# EasyEDA Pro project 2021江西省焊接赛.eprj

# Schematic Schematic1
Create Date: 2024-03-24; Page Name: P1; Project Name: 2021江西省焊接赛; Schematic Name: Schematic1; Update Date: 2024-03-24; Company: 嘉立创EDA; Page Size: A4; Version: V1.0
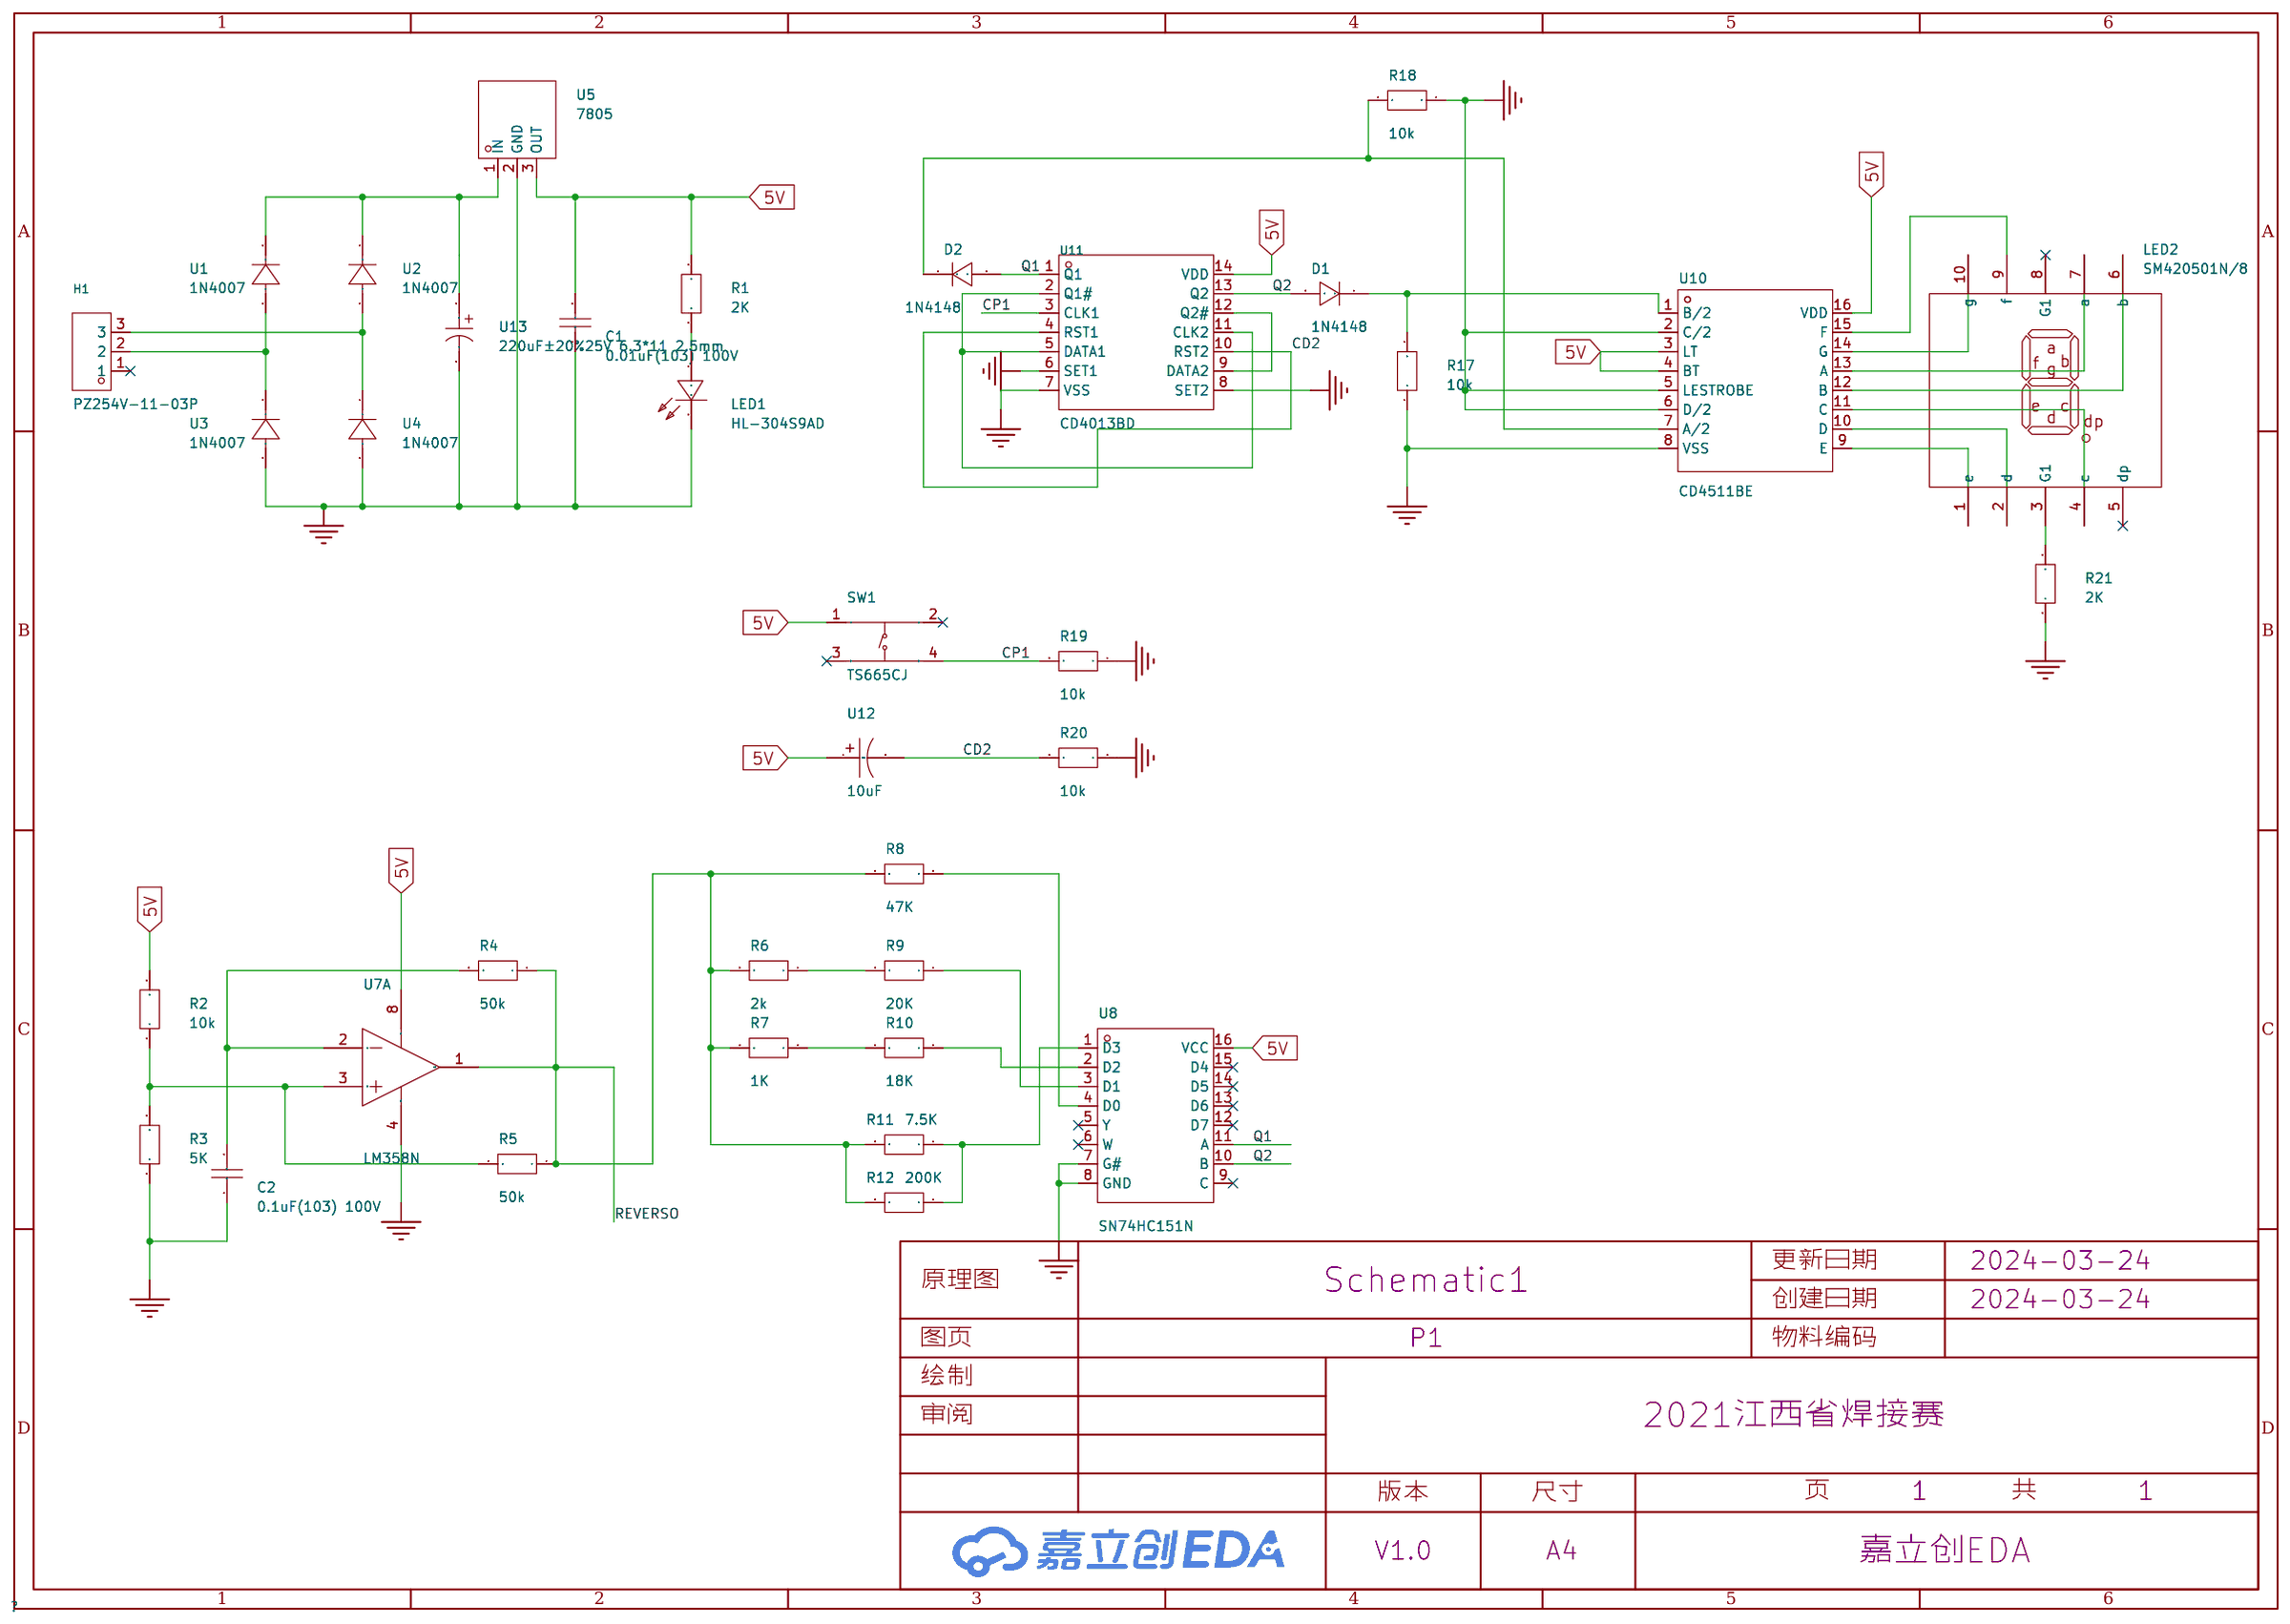
[diagram p0: schematic sheet]

## Parts
C1  0.01uF(103) 100V  [CAP-TH_L5.5-W3.0-P5.00-D0.5]
C2  0.1uF(103) 100V  [CAP-TH_L5.5-W3.0-P5.00-D0.5]
D1  1N4148  [DO-35_BD2.0-L4.0-P8.0-D0.5-RD]
D2  1N4148  [DO-35_BD2.0-L4.0-P8.0-D0.5-RD]
H1  PZ254V-11-03P  [HDR-TH_3P-P2.54-V-M]
LED1  HL-304S9AD  [LED-TH_BD3.0-P2.54-FD]
LED2  SM420501N/8  [LED-SEG-TH_10P-L12.7-W19.0-P2.54-S15.24-BL]
R1  2K  [RES-TH_BD2.3-L6.5-P10.50-D0.5]
R2  10k  [RES-TH_BD2.3-L6.5-P10.50-D0.5]
R3  5K  [RES-TH_BD2.3-L6.5-P10.50-D0.5]
R4  50k  [RES-TH_BD2.3-L6.5-P10.50-D0.5]
R5  50k  [RES-TH_BD2.3-L6.5-P10.50-D0.5]
R6  2k  [RES-TH_BD2.3-L6.5-P10.50-D0.5]
R7  1K  [RES-TH_BD2.3-L6.5-P10.50-D0.5]
R8  47K  [RES-TH_BD2.3-L6.5-P10.50-D0.5]
R9  20K  [RES-TH_BD2.3-L6.5-P10.50-D0.5]
R10  18K  [RES-TH_BD2.3-L6.5-P10.50-D0.5]
R11  7.5K  [RES-TH_BD2.3-L6.5-P10.50-D0.5]
R12  200K  [RES-TH_BD2.3-L6.5-P10.50-D0.5]
R17  10k  [RES-TH_BD2.3-L6.5-P10.50-D0.5]
R18  10k  [RES-TH_BD2.3-L6.5-P10.50-D0.5]
R19  10k  [RES-TH_BD2.3-L6.5-P10.50-D0.5]
R20  10k  [RES-TH_BD2.3-L6.5-P10.50-D0.5]
R21  2K  [RES-TH_BD2.3-L6.5-P10.50-D0.5]
SW1  TS665CJ  [SW-TH_4P-L6.0-W6.0-P4.50-LS6.5]
U1  1N4007  [DO-41_BD2.8-L5.2-P9.20-D0.8-RD]
U2  1N4007  [DO-41_BD2.8-L5.2-P9.20-D0.8-RD]
U3  1N4007  [DO-41_BD2.8-L5.2-P9.20-D0.8-RD]
U4  1N4007  [DO-41_BD2.8-L5.2-P9.20-D0.8-RD]
U5  7805  [TO-220-3_L10.2-W4.5-P2.54-L-1]
U7  LM358N  [DIP-8_L9.2-W6.3-P2.54-LS7.62-BL]  (section 1)
U8  SN74HC151N  [PDIP-16_L19.7-W6.6-P2.54-LS7.8-BL]
U10  CD4511BE  [DIP-16_L19.8-W6.5-P2.54-LS7.6-BL]
U11  CD4013BD  [DIP-14_L19.6-W6.4-P2.54-LS7.6-BL]
U12  10uF  [CAP-TH_BD6.3-P2.50-D0.5-FD]
U13  220uF±20%25V 6.3*11 2.5mm  [CAP-TH_BD6.3-P2.50-D0.5-FD]

## Library data of the parts
C1 C2 = 0.01uF(103) 100V: LCSC Part Name: 10nF (103) 100V   P=5mm; Supplier Part: C10722; Supplier Footprint: 插件; JLCPCB Part Class: 扩展库; Supplier: LCSC
D1 D2 = 1N4148_C13769: 二极管配置:-;正向压降(Vf):-;直流反向耐压(Vr):-;平均整流电流(Io):-;; Supplier Part: C13769; Supplier Footprint: DO-35; JLCPCB Part Class: 扩展库; Supplier: LCSC
H1 = PZ254V-11-03P: 插针结构:1x3P;间距:2.54mm;行距:-;圆针/方针:方针;安装类型:直插;排数:单排;总PIN位数:3P;额定电流:3A;额定电压:250V;配合针长度:6mm;塑高:2.5mm;端接针长度:3mm;工作温度范围:-40℃~+105℃;颜色:黑色;; LCSC Part Name: 间距:2.54mm 1x3P 直插 方针; Supplier Part: C2937625; Manufacturer: XFCN(兴飞); Supplier Footprint: 插件,P=2.54mm; JLCPCB Part Class: 扩展库; Datasheet: https://atta.szlcsc.com/upload/public/pdf/source/20200309/C492402_8335C3D49C4E4C618838D59BB1D024C1.pdf; Supplier: LCSC; Pin Structure: 1x3P; Pitch: 2.54mm; Circluar Pins/Square Pins: 方针; Mounting Type: 直插; Number of Rows: 单排; Number of Pins: 3P; Current Rating (Max): 3A; Voltage Rating (Max): 250V; Length of Mating Pin: 6mm; Insulation Height: 2.5mm; Length of End Connection Pin: 3mm; Operating Temperature Range: -40℃~+105℃; Color: 黑色
LED1 = HL-304S9AD: 灯头类型:3mm圆形灯头;发光颜色:红色;正向电压(VF):2.2V;功率:66mW;正向电流:20mA;主波长:627nm~635nm;二极管配置:-;透镜颜色:雾状红透镜;色温:-;发光强度:460mcd;发光角度:40°;载带方式:-;工作温度:-30℃~+80℃;; Supplier Part: C568936; Manufacturer: HONGLITRONIC(鸿利光电); Supplier Footprint: 插件,D=3mm; JLCPCB Part Class: 扩展库; Datasheet: https://atta.szlcsc.com/upload/public/pdf/source/20200630/C568936_361459151DDEDF72172B9683A2A9AC96.pdf; Supplier: LCSC; Lamp Holder Type: 3mm圆形灯头; Emitted Color: 红色; Forward Voltage (VF): 2.2V; Power Dissipation: 66mW; Forward Current: 20mA; Dominant Wavelength: 627nm~635nm; Lens Color: 雾状红透镜; Luminous Intensity: 460mcd; Viewing Angle: 40°; Operating Temperature: -30℃~+80℃
LED2 = SM420501N/8: 数码管位数:1位;发光颜色:红色;LED极性:共阴极;数字/字母大小(英寸):0.5;; LCSC Part Name: 1位0.5英寸红色数码管 共阴极; Supplier Part: C252201; Manufacturer: ARKLED(方舟); Supplier Footprint: 插件; JLCPCB Part Class: 扩展库; Datasheet: https://atta.szlcsc.com/upload/public/pdf/source/20180821/C252201_1E0130B228B09D4E21858CDC1E7784AB.pdf; Supplier: LCSC; Number of Characters: 1位; Luminous Color: 红色; LED Polarity: 共阴极; Digit/Alpha Size(inch): 0.5
R1-R12 R17-R21 = MF1/4W-1KΩ±1%T52: 电阻类型:金属膜电阻;阻值:1kΩ;精度:±1%;功率:250mW;温度系数:±200ppm/℃;; LCSC Part Name: 金属膜电阻 1kΩ ±1% 250mW; Supplier Part: C713997; Manufacturer: 华星机电; Supplier Footprint: 插件; JLCPCB Part Class: Extended Part; Datasheet: https://atta.szlcsc.com/upload/public/pdf/source/20200731/C713882_AE8EB1102749D7E4FB4FB13DC898C429.pdf; Supplier: LCSC; Type: 金属膜电阻; Tolerance: ±1%; Power(Watts): 250mW; Temperature Coefficient: ±200ppm/℃
SW1 = TS665CJ: 电路结构:单刀单掷;按钮形状:圆形按钮;安装方式:直插;开关长度:6mm;开关宽度:6mm;开关高度:5mm;触点电流:50mA;额定电压(DC):12V;带灯:-;机械寿命:-;; LCSC Part Name: 6*6*5mm 直插 轻触开关; Supplier Part: C393938; Manufacturer: SHOU HAN(首韩); Supplier Footprint: 插件; JLCPCB Part Class: 扩展库; Datasheet: https://atta.szlcsc.com/upload/public/pdf/source/20190521/C393938_BDABEAC600B4C55E200A80AA129B70BC.pdf; Supplier: LCSC; Circuit: 单刀单掷; Actuator Style: 圆形按钮; Mounting Style: 直插; Switch Length: 6mm; Switch Width: 6mm; Switch Height: 5mm; Contact Current: 50mA; Voltage Rating (DC): 12V
U1-U4 = 1N4007_C19272205: Supplier Part: C19272205; Manufacturer: Zhengxin(正芯); Supplier Footprint: DO-41; Datasheet: https://atta.szlcsc.com/upload/public/pdf/source/20231208/D31AFEBA3B57F695AB8DB795E02A4800.pdf; Supplier: LCSC
U5 = 7805: 输出类型:固定;最大输入电压:35V;输出电压:5V;最大输出电流:1.5A;电源纹波抑制比(PSRR):62dB@(120Hz);输出极性:正极;; LCSC Part Name: 输入35V 输出5V 1.5A; Supplier Part: C4944936; Manufacturer: SY(顺烨）; Supplier Footprint: TO-220AB; JLCPCB Part Class: 扩展库; Datasheet: https://atta.szlcsc.com/upload/public/pdf/source/20220719/323A3F14557C229271C454C7C0F759A5.pdf; Supplier: LCSC; Output Type: 固定; Maximum Input Voltage: 35V; Output Voltage: 5V; MAX Output Current: 1.5A; Power Supply Rejection Ratio (PSRR): 62dB@(120Hz); Output Polarity: 正极
U7 = LM358N: 放大器数:-;; Supplier Part: C434570; Manufacturer: HGSEMI(华冠); Supplier Footprint: DIP-8; JLCPCB Part Class: 扩展库; Datasheet: https://atta.szlcsc.com/upload/public/pdf/source/20201104/C398078_C03AD53C2769C23315C184712D62478F.pdf; Supplier: LCSC
U8 = SN74HC151N: 供电电压:2V~6V;灌电流(IOL):7.8mA;拉电流(IOH):7.8mA;; Supplier Part: C157528; Manufacturer: TI(德州仪器); Supplier Footprint: PDIP-16; Datasheet: https://www.ti.com/cn/lit/gpn/sn74hc151; Supplier: LCSC; Type: 多路复用器; Voltage Supply Source: 单电源; Supply Voltage: 2V~6V; Sink Current: 7.8mA; Source Current: 7.8mA; Operating temperature: -40℃~+85℃
U10 = CD4511BE: CD4511B CMOS BCD 到 7 段 LED 锁存解码器驱动器; Supplier Part: C5327; Manufacturer: TI(德州仪器); Supplier Footprint: DIP-16; JLCPCB Part Class: 扩展库; Datasheet: https://www.ti.com/cn/lit/gpn/cd4511b; Supplier: LCSC
U11 = CD4013BD: 类型:D-型;; Supplier Part: C5274713; Manufacturer: Sungine(双竞集成); Supplier Footprint: DIP-14; Datasheet: https://atta.szlcsc.com/upload/public/pdf/source/20221121/44CACF82E4E0EA70321374EADD4D28B0.pdf; Supplier: LCSC; Type: D-型
U12 = MHT10UF400V87EC0217: 容值:10uF;精度:±20%;额定电压:400V;纹波电流:-;等效串联电阻:-;; LCSC Part Name: 10uF ±20% 400V; Supplier Part: C3034527; Manufacturer: KNSCHA(科尼盛); Supplier Footprint: 插件,D6.3xL16mm; JLCPCB Part Class: 扩展库; Datasheet: https://atta.szlcsc.com/upload/public/pdf/source/20220613/BAC6EB237FF3CCD33B76A42FEFFA13DA.pdf; Supplier: LCSC; Tolerance: ±20%; Rated Voltage: 400V; φD: 6.3mm; L: 16mm
U13 = 220uF±20%25V 6.3*11 2.5mm: Supplier Part: C9900018463; Supplier Footprint: 220uF±20％25V-6.3*11-2.5mm-吉光; JLCPCB Part Class: 扩展库; Supplier: LCSC

## Nets
5V: C1.2 R1.2 R2.2 SW1.1(A) U5.3(OUT) U7.8(VCC) U8.16(VCC) U10.3(LT) U10.4(BT) U10.16(VDD) U11.14(VDD) U12.1
GND: C1.1 C2.1 LED1.2(C) R3.1 R17.1 R18.1 R19.1 R20.1 R21.1 U3.2(A) U4.2(A) U5.2(GND) U7.4(GND) U8.7(G#) U8.8(GND) U10.2(C/2) U10.5(LESTROBE) U10.6(D/2) U10.8(VSS) U11.6(SET1) U11.7(VSS) U11.8(SET2) U13.2
CD2: R20.2 U11.4(RST1) U11.10(RST2) U12.2
CP1: R19.2 SW1.4(D) U11.3(CLK1)
Q1: D2.2 U8.11(A) U11.1(Q1)
Q2: D1.2 U8.10(B) U11.13(Q2)
REVERSO: R4.1 R5.1 R6.2 R7.2 R8.2 R11.2 R12.2 U7.1(OUT1)
$1N523: LED1.1(A) R1.1
$1N655: H1.3 U2.2(A) U4.1(K)
$1N665: H1.2 U1.2(A) U3.1(K)
$1N699: U1.1(K) U2.1(K) U5.1(IN) U13.1
$1N984: C2.2 R4.2 U7.2(IN1-)
$1N1320: R2.1 R3.2 R5.2 U7.3(IN1+)
$1N1806: R11.1 R12.1 U8.1(D3)
$1N1814: R10.1 U8.2(D2)
$1N1819: R7.1 R10.2
$1N1822: R6.1 R9.2
$1N1825: R9.1 U8.3(D1)
$1N1830: R8.1 U8.4(D0)
$1N3999: LED2.9(f) U10.15(F)
$1N4011: LED2.10(g) U10.14(G)
$1N4015: LED2.7(a) U10.13(A)
$1N4019: LED2.6(b) U10.12(B)
$1N4023: LED2.4(c) U10.11(C)
$1N4027: LED2.2(d) U10.10(D)
$1N4031: LED2.1(e) U10.9(E)
$1N4101: LED2.3(G1) R21.2
$1N5836: D1.1 R17.2 U10.1(B/2)
$1N5995: D2.1 R18.2 U10.7(A/2)
$1N6063: U11.9(DATA2) U11.12(Q2#)
$1N6114: U11.2(Q1#) U11.5(DATA1) U11.11(CLK2)

Not connected (* = marked no-connect by the designer): H1 1*; LED2 5(dp)* 8(G1)*; SW1 2(B)* 3(C)*; U8 5(Y)* 6(W)* 9(C)* 12(D7)* 13(D6)* 14(D5)* 15(D4)*

# Board PCB1
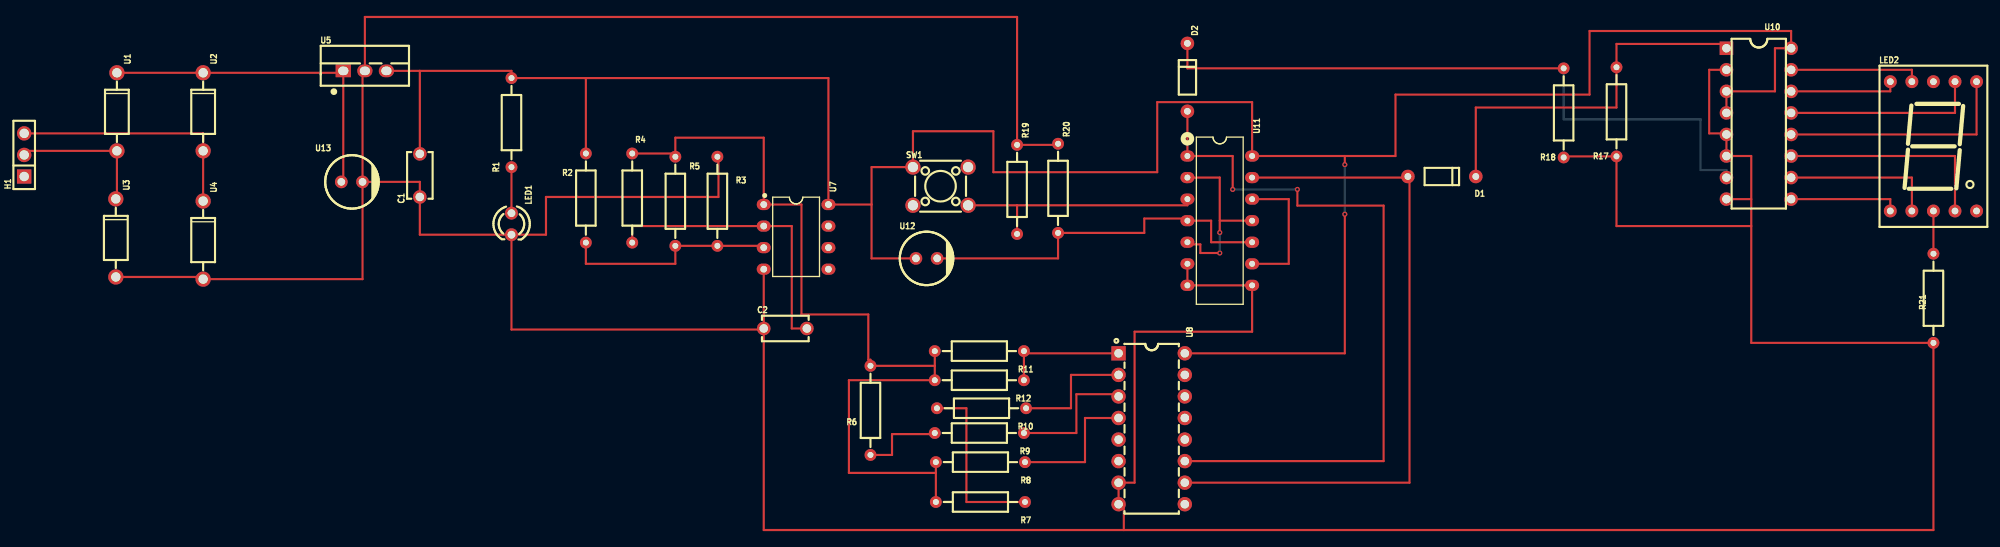
[diagram p1: board, top side]
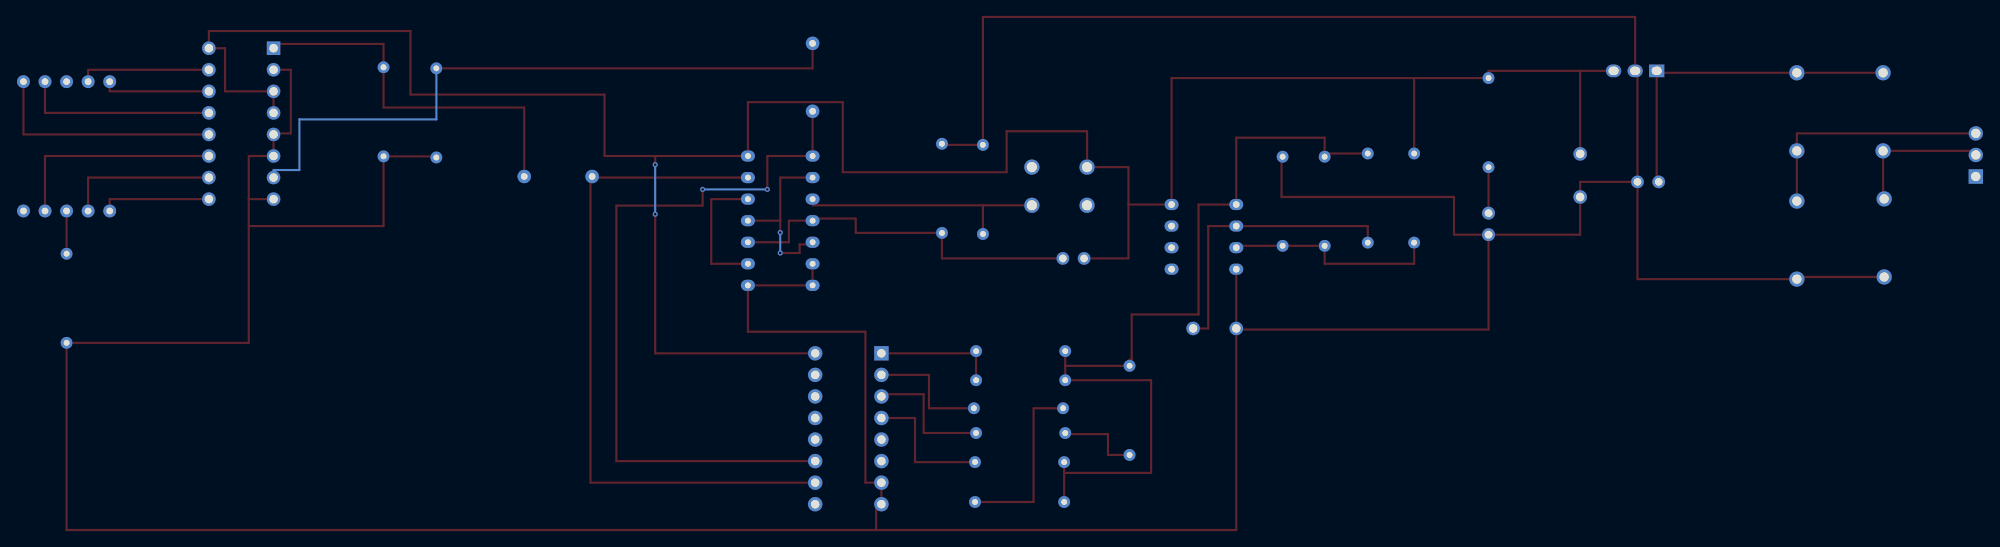
[diagram p2: board, bottom side, seen from below]

No outline. copper layers: Top Layer, Bottom Layer. Coordinates in mm from the lowest, leftmost part position.
Stack: Top Layer 0.035mm / Dielectric1 1.51mm FR4 er 4.5 / Bottom Layer 0.035mm

## Design rules (mm)
template: JLCPCB Capability(Two Layers Board)
spacing copperThickness1oz (default): track to track 0.102, other pairs 0.152 to 0.3
spacing copperThickness2oz: track to track 0.203, other pairs 0.152 to 0.3
track width copperThickness1oz (default): min 0.127, default 0.254, max 2.54
track width copperThickness2oz: min 0.203, default 0.254, max 2.54
differential pair differentialPair (default): width min 0.127, default 0.254, max 2.54; gap min 0.152, default 0.152
via viaSize (default): diameter min 0.5, default 0.61, max 10; hole min 0.3, default 0.305, max 6.3

## Placement (name value [footprint] x y rotation side)
C1  0.01uF(103) 100V  [CAP-TH_L5.5-W3.0-P5.00-D0.5]  46.61 38.48 90 top
C2  0.1uF(103) 100V  [CAP-TH_L5.5-W3.0-P5.00-D0.5]  89.66 20.45 0 top
D1  1N4148  [DO-35_BD2.0-L4.0-P8.0-D0.5-RD]  167 38.35 180 top
D2  1N4148  [DO-35_BD2.0-L4.0-P8.0-D0.5-RD]  137.03 50.04 270 top
H1  PZ254V-11-03P  [HDR-TH_3P-P2.54-V-M]  0 40.89 90 top
LED1  HL-304S9AD  [LED-TH_BD3.0-P2.54-FD]  57.4 32.77 270 top
LED2  SM420501N/8  [LED-SEG-TH_10P-L12.7-W19.0-P2.54-S15.24-BL]  224.92 41.91 0 top
R1  2K  [RES-TH_BD2.3-L6.5-P10.50-D0.5]  57.4 44.7 90 top
R2  10k  [RES-TH_BD2.3-L6.5-P10.50-D0.5]  66.17 35.81 90 top
R3  5K  [RES-TH_BD2.3-L6.5-P10.50-D0.5]  81.66 35.43 270 top
R4  50k  [RES-TH_BD2.3-L6.5-P10.50-D0.5]  71.63 35.81 270 top
R5  50k  [RES-TH_BD2.3-L6.5-P10.50-D0.5]  76.71 35.43 270 top
R6  2k  [RES-TH_BD2.3-L6.5-P10.50-D0.5]  99.7 10.79 90 top
R7  1K  [RES-TH_BD2.3-L6.5-P10.50-D0.5]  112.65 0 180 top
R8  47K  [RES-TH_BD2.3-L6.5-P10.50-D0.5]  112.65 4.7 180 top
R9  20K  [RES-TH_BD2.3-L6.5-P10.50-D0.5]  112.52 8.13 180 top
R10  18K  [RES-TH_BD2.3-L6.5-P10.50-D0.5]  112.78 11.05 180 top
R11  7.5K  [RES-TH_BD2.3-L6.5-P10.50-D0.5]  112.52 17.78 180 top
R12  200K  [RES-TH_BD2.3-L6.5-P10.50-D0.5]  112.52 14.35 180 top
R17  10k  [RES-TH_BD2.3-L6.5-P10.50-D0.5]  187.58 45.97 90 top
R18  10k  [RES-TH_BD2.3-L6.5-P10.50-D0.5]  181.36 45.85 90 top
R19  10k  [RES-TH_BD2.3-L6.5-P10.50-D0.5]  116.97 36.83 270 top
R20  10k  [RES-TH_BD2.3-L6.5-P10.50-D0.5]  121.79 36.96 270 top
R21  2K  [RES-TH_BD2.3-L6.5-P10.50-D0.5]  224.92 24 90 top
SW1  TS665CJ  [SW-TH_4P-L6.0-W6.0-P4.50-LS6.5]  107.95 37.21 0 top
U1  1N4007  [DO-41_BD2.8-L5.2-P9.20-D0.8-RD]  10.92 45.97 270 top
U2  1N4007  [DO-41_BD2.8-L5.2-P9.20-D0.8-RD]  21.08 45.97 270 top
U3  1N4007  [DO-41_BD2.8-L5.2-P9.20-D0.8-RD]  10.8 31.11 270 top
U4  1N4007  [DO-41_BD2.8-L5.2-P9.20-D0.8-RD]  21.08 30.86 270 top
U5  7805  [TO-220-3_L10.2-W4.5-P2.54-L-1]  40.13 50.8 0 top
U7  LM358N  [DIP-8_L9.2-W6.3-P2.54-LS7.62-BL]  90.93 31.24 270 top
U8  SN74HC151N  [PDIP-16_L19.7-W6.6-P2.54-LS7.8-BL]  132.82 8.63 270 top
U10  CD4511BE  [DIP-16_L19.8-W6.5-P2.54-LS7.6-BL]  204.34 44.58 270 top
U11  CD4013BD  [DIP-14_L19.6-W6.4-P2.54-LS7.6-BL]  140.84 33.15 270 top
U12  10uF  [CAP-TH_BD6.3-P2.50-D0.5-FD]  106.3 28.7 0 top
U13  220uF±20%25V 6.3*11 2.5mm  [CAP-TH_BD6.3-P2.50-D0.5-FD]  38.61 37.72 0 top

## Footprints (pads in the part's own frame, mm; a bottom-side part is the same pattern mirrored in y, then rotated)
CAP-TH_BD6.3-P2.50-D0.5-FD
  round 1.5 hole 0.9: 1(-1.25,0) 2(1.25,0)
CAP-TH_L5.5-W3.0-P5.00-D0.5
  round 1.6 hole 1: 1(-2.54,0) 2(2.54,0)
DIP-8_L9.2-W6.3-P2.54-LS7.62-BL
  oval 1.32x1.65 hole 0.8: 1(-3.81,-3.81) 2(-1.27,-3.81) 3(1.27,-3.81) 4(3.81,-3.81) 5(3.81,3.81) 6(1.27,3.81) 7(-1.27,3.81) 8(-3.81,3.81)
DIP-14_L19.6-W6.4-P2.54-LS7.6-BL
  oval 1.32x1.65 hole 0.7: 1(-7.62,-3.81) 2(-5.08,-3.81) 3(-2.54,-3.81) 4(0,-3.81) 5(2.54,-3.81) 6(5.08,-3.81) 7(7.62,-3.81) 8(7.62,3.81) 9(5.08,3.81) 10(2.54,3.81) 11(0,3.81) 12(-2.54,3.81) 13(-5.08,3.81) 14(-7.62,3.81)
DIP-16_L19.8-W6.5-P2.54-LS7.6-BL
  rect 1.6x1.6 hole 1: 1(-8.89,-3.81)
  round 1.6 hole 1: 2(-6.35,-3.81) 3(-3.81,-3.81) 4(-1.27,-3.81) 5(1.27,-3.81) 6(3.81,-3.81) 7(6.35,-3.81) 8(8.89,-3.81) 9(8.89,3.81) 10(6.35,3.81) 11(3.81,3.81) 12(1.27,3.81) 13(-1.27,3.81) 14(-3.81,3.81) 15(-6.35,3.81) 16(-8.89,3.81)
DO-35_BD2.0-L4.0-P8.0-D0.5-RD
  round 1.6 hole 0.8: 1(-4,0) 2(4,0)
DO-41_BD2.8-L5.2-P9.20-D0.8-RD
  round 1.8 hole 1.1: 1(-4.6,0) 2(4.6,0)
HDR-TH_3P-P2.54-V-M
  rect 1.7x1.7 hole 1.1: 1(-2.54,0)
  round 1.7 hole 1.1: 2(0,0) 3(2.54,0)
LED-SEG-TH_10P-L12.7-W19.0-P2.54-S15.24-BL
  round 1.524 hole 0.8: 1(-5.08,-7.62) 2(-2.54,-7.62) 3(0,-7.62) 4(2.54,-7.62) 5(5.08,-7.62) 6(5.08,7.62) 7(2.54,7.62) 8(0,7.62) 9(-2.54,7.62) 10(-5.08,7.62)
LED-TH_BD3.0-P2.54-FD
  round 1.524 hole 0.914: 1(-1.27,0) 2(1.27,0)
PDIP-16_L19.7-W6.6-P2.54-LS7.8-BL
  rect 1.7x1.7 hole 1: 1(-8.89,-3.9)
  round 1.7 hole 1: 2(-6.35,-3.9) 3(-3.81,-3.9) 4(-1.27,-3.9) 5(1.27,-3.9) 6(3.81,-3.9) 7(6.35,-3.9) 8(8.89,-3.9) 9(8.89,3.9) 10(6.35,3.9) 11(3.81,3.9) 12(1.27,3.9) 13(-1.27,3.9) 14(-3.81,3.9) 15(-6.35,3.9) 16(-8.89,3.9)
RES-TH_BD2.3-L6.5-P10.50-D0.5
  round 1.4 hole 0.7: 1(-5.25,0) 2(5.25,0)
SW-TH_4P-L6.0-W6.0-P4.50-LS6.5
  round 1.8 hole 1.2: 1(-3.25,2.25) 2(3.25,2.25) 3(-3.25,-2.25) 4(3.25,-2.25)
TO-220-3_L10.2-W4.5-P2.54-L-1
  rect 1.8x1.5 hole 1.2x1: 1(-2.54,0)
  oval 1.8x1.5 hole 1.2x1: 2(0,0) 3(2.54,0)

## Nets
As in the schematic.

Pads without a net: H1 1; LED2 5 8; SW1 2 3; U7 5 6 7; U8 5 6 9 12 13 14 15

## Via types
v1: diameter 0.61, hole 0.305, Top Layer to Bottom Layer, 6 vias

## Routing (per net, layer and track width the routed paths; a pad name or vN(x,y) marks a point on that pad's centre or on a via; arc(x,y) is an arc through that point)
5V: length 313.6
  Top Layer w0.254: 99.82,35.05 U7.8 94.74,49.95 66.17,49.95 ; 99.82,35.05 99.82,39.46 SW1.1 104.7,43.69 114.17,43.69 114.17,38.86 133.48,38.86 133.48,47.12 144.65,47.12 U11.14 155.57,40.77 ; 99.82,35.05 99.82,28.7 U12.1 ; U8.16 155.57,17.52 v1(155.57,33.91) ; 46.61,50.8 57.4,50.8 R1.2 66.17,49.95 ; 46.61,50.8 C1.2 ; 46.61,50.8 U5.3 ; 66.17,49.95 R2.2 ; v1(155.57,39.75) 155.57,40.77 ; 155.57,40.77 161.54,40.77 161.54,48.01 184.4,48.01 184.4,55.5 208.15,55.5 U10.16 206.25,53.47 206.25,48.39 U10.3 U10.4
  Bottom Layer w0.254: v1(155.57,33.91) v1(155.57,39.75)
GND: length 595.6
  Top Layer w0.254: LED1.2 46.61,31.5 C1.1 46.61,37.72 U13.2 ; LED1.2 61.47,31.5 61.47,35.94 81.79,35.94 81.79,40.68 R3.1 ; LED1.2 57.4,20.32 87.12,20.32 ; R18.1 181.36,40.72 R17.1 187.58,32.51 203.45,32.51 ; U13.2 39.86,50.8 U5.2 40.13,57.15 116.97,57.15 R19.1 121.79,42.08 R20.1 ; U13.2 39.86,26.26 U4.2 21.08,26.51 U3.2 ; 129.54,-3.3 129.54,-0.26 U8.8 U8.7 130.81,2.28 130.81,20.07 144.65,20.07 U11.8 U11.7 137.03,28.07 ; 129.54,-3.3 87.12,-3.3 87.12,20.32 ; 129.54,-3.3 224.92,-3.3 R21.1 203.45,18.75 203.45,32.51 ; 203.45,35.69 U10.8 ; 203.45,35.69 203.45,32.51 ; 203.45,35.69 203.45,40.77 U10.6 U10.5 200.53,43.43 198.5,43.43 198.5,50.93 U10.2 ; U7.4 C2.1 87.12,20.32
CD2: length 44.6
  Top Layer w0.254: U12.2 121.79,28.7 R20.2 131.95,31.71 131.95,33.4 137.03,33.4 U11.4 139.83,33.15 139.83,30.61 U11.10
CP1: length 29.9
  Top Layer w0.254: U11.3 137.03,34.96 116.97,34.96 ; SW1.4 116.97,34.96 ; 116.97,34.96 R19.2
Q1: length 87.8
  Top Layer w0.254: v1(149.99,36.83) 149.99,34.92 160.15,34.92 160.15,4.82 U8.11 ; v1(142.37,36.83) 142.37,40.77 U11.1 D2.2
  Bottom Layer w0.254: v1(149.99,36.83) v1(142.37,36.83)
Q2: length 81
  Top Layer w0.254: U8.10 163.19,2.28 163.19,38.23 U11.13
REVERSO: length 104.2
  Top Layer w0.254: R4.1 76.71,41.06 ; 76.71,41.06 R5.1 ; 76.71,41.06 76.71,42.93 87.12,42.93 U7.1 91.57,35.05 91.57,22.1 99.44,22.1 99.44,16.76 99.7,16.76 R6.2 107.27,16.04 ; 107.4,3.43 R7.2 ; 107.4,3.43 R8.2 ; 107.4,3.43 97.16,3.43 97.16,14.35 R12.2 107.27,16.04 ; 107.27,16.04 R11.2
$1N523: length 5.4
  Top Layer w0.254: R1.1 LED1.1
$1N655: length 29.3
  Top Layer w0.254: -0.25,43.43 21.08,43.43 U2.2 U4.1
$1N665: length 16.9
  Top Layer w0.254: 10.8,35.72 10.92,35.72 U1.2 0.48,41.37 H1.2
$1N699: length 40
  Top Layer w0.254: 37.59,50.57 37.59,37.72 U13.1 ; 37.59,50.57 U5.1 ; 37.59,50.57 U2.1 U1.1
$1N984: length 34.6
  Top Layer w0.254: C2.2 90.42,20.45 90.42,32.51 U7.2 71.63,32.51 R4.2
$1N1320: length 25.8
  Top Layer w0.254: R2.1 66.17,28.07 76.71,28.07 R5.2 R3.2 87.12,30.18 U7.3
$1N1806: length 14.6
  Top Layer w0.254: U8.1 117.77,17.52 ; 117.77,17.52 R12.1 ; 117.77,17.52 R11.1
$1N1814: length 14.8
  Top Layer w0.254: R10.1 123.32,11.05 123.32,14.98 U8.2
$1N1819: length 21.4
  Top Layer w0.254: R7.1 111,0 111,11.05 R10.2
$1N1822: length 10.2
  Top Layer w0.254: R6.1 102.23,5.54 102.23,8 107.27,8 R9.2
$1N1825: length 15.8
  Top Layer w0.254: U8.3 128.66,12.7 123.95,12.7 123.95,8.13 R9.1
$1N1830: length 16.2
  Top Layer w0.254: U8.4 124.97,9.9 124.97,4.7 R8.1
$1N3999: length 15.6
  Top Layer w0.254: LED2.9 222.38,50.93 U10.15
$1N4011: length 12.8
  Top Layer w0.254: LED2.10 219.84,48.39 U10.14
$1N4015: length 23
  Top Layer w0.254: LED2.7 227.46,45.85 U10.13
$1N4019: length 28.1
  Top Layer w0.254: U10.12 230,43.31 LED2.6
$1N4023: length 25.8
  Top Layer w0.254: LED2.4 227.46,40.77 U10.11
$1N4027: length 18.2
  Top Layer w0.254: U10.10 222.38,38.23 LED2.2
$1N4031: length 13.1
  Top Layer w0.254: U10.9 219.84,35.69 LED2.1
$1N4101: length 5
  Top Layer w0.254: LED2.3 R21.2
$1N5836: length 45.4
  Top Layer w0.254: U10.1 200.02,53.97 187.58,53.97 R17.2 187.58,46.48 171,46.48 D1.1
$1N5995: length 79.3
  Top Layer w0.254: D2.1 137.03,51.1 R18.2
  Bottom Layer w0.254: R18.2 181.36,45.09 197.49,45.09 197.49,39.12 200.53,39.12 U10.7
$1N6063: length 16.3
  Top Layer w0.254: 144.65,28.07 148.97,28.07 148.97,35.69 U11.12
$1N6114: length 21.6
  Top Layer w0.254: v1(140.84,29.34) 138.56,29.34 138.56,30.35 137.03,30.35 U11.5 ; U11.2 140.84,38.23 140.84,33.15 ; 140.84,33.15 U11.11 ; 140.84,33.15 v1(140.84,31.75)
  Bottom Layer w0.254: v1(140.84,31.75) v1(140.84,29.34)
